# EAGLE schematic Flirry (EAGLE 7.5.0)
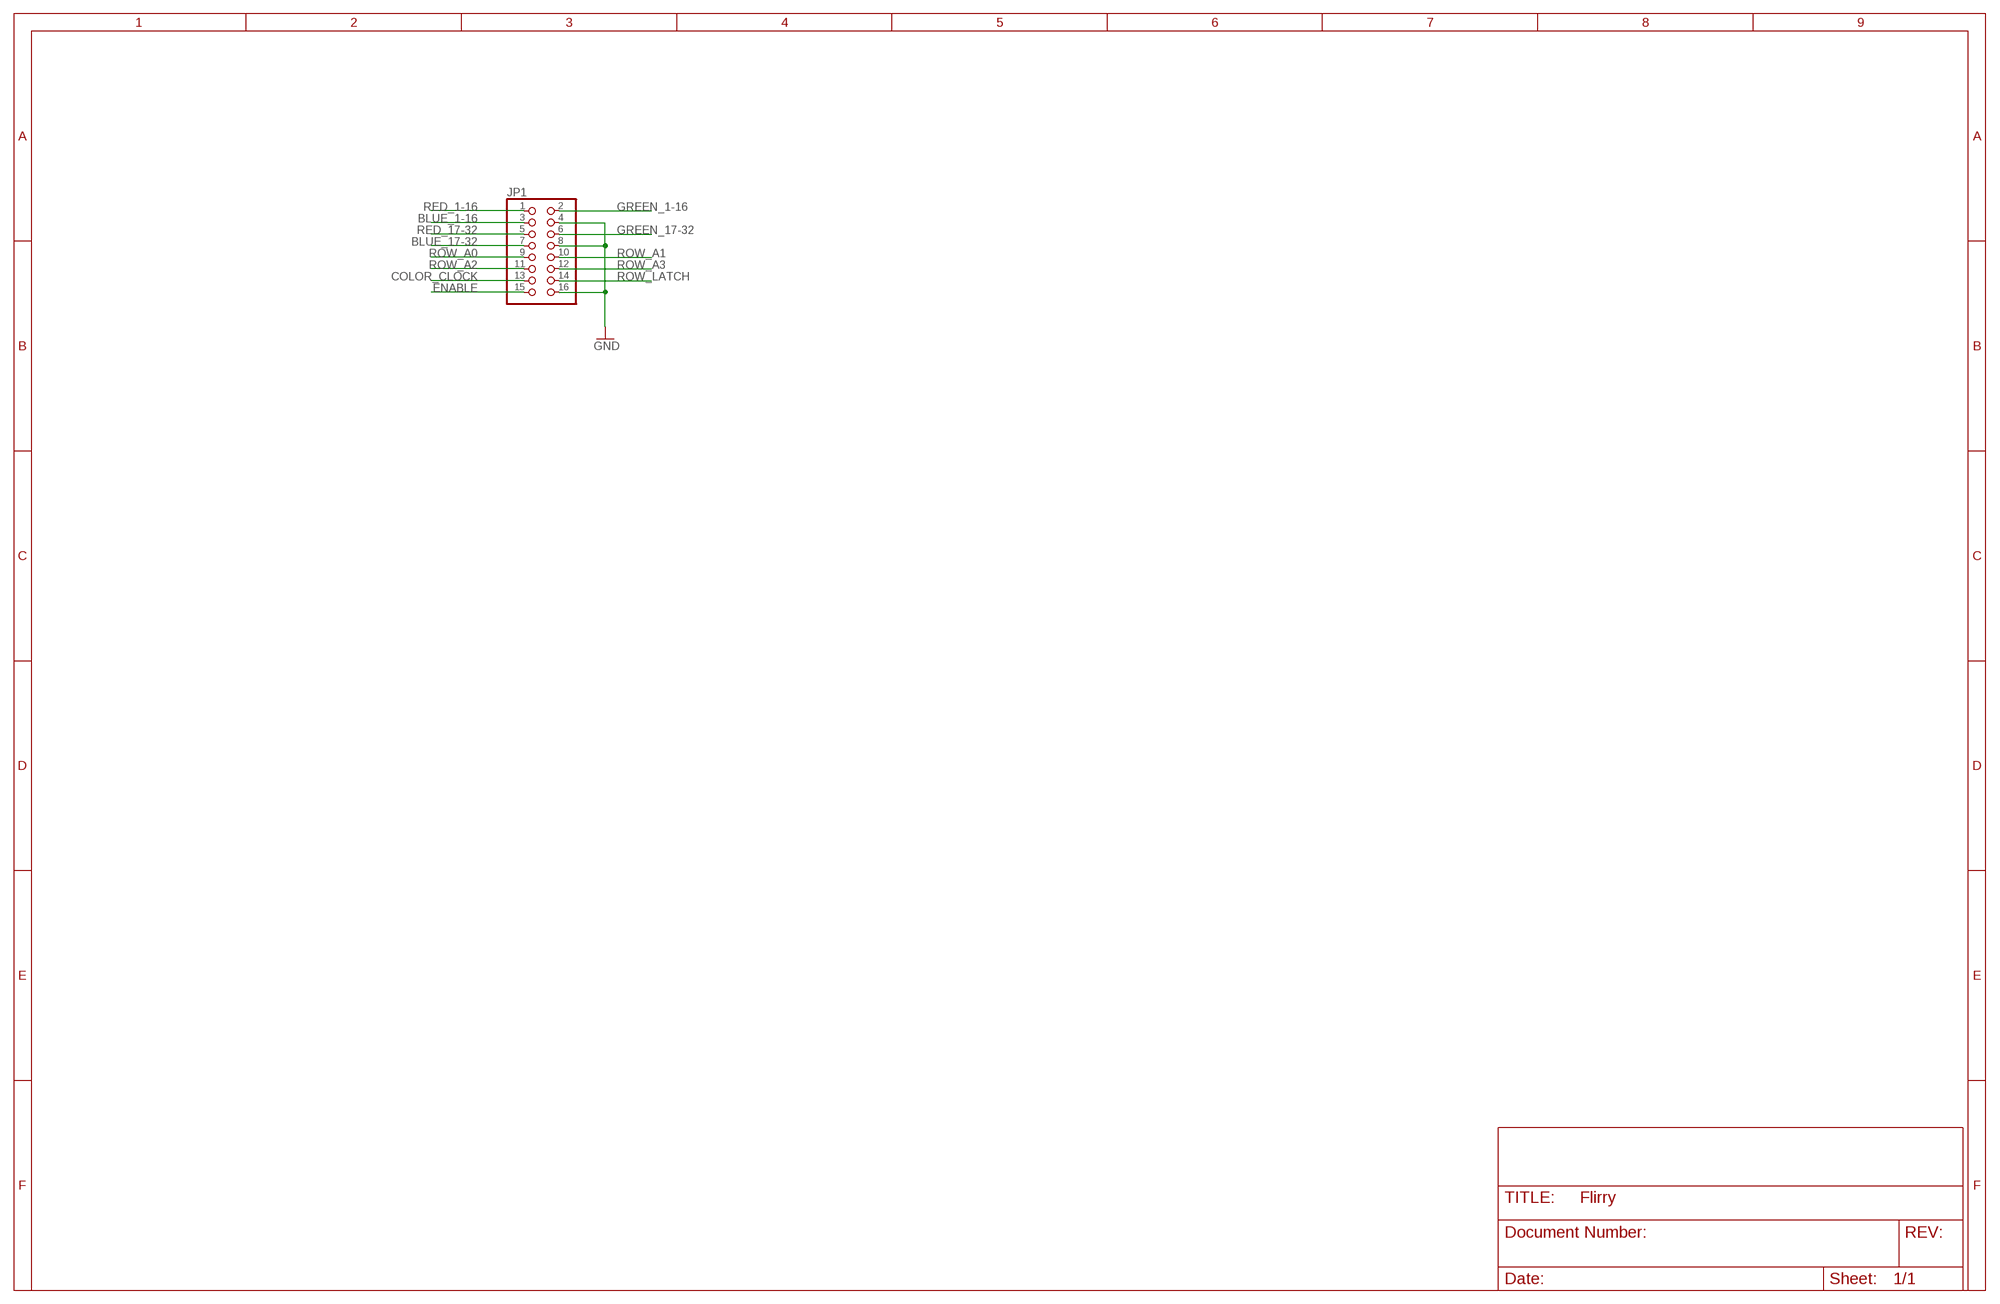
[diagram p0: schematic, sheet 1]

## Parts
JP1  PINHD-2X8  [2X08]

## Nets
BLUE_1-16: JP1.3
BLUE_17-32: JP1.7
COLOR_CLOCK: JP1.13
ENABLE: JP1.15
GND: JP1.4 JP1.8 JP1.16
GREEN_1-16: JP1.2
GREEN_17-32: JP1.6
RED_1-16: JP1.1
RED_17-32: JP1.5
ROW_A0: JP1.9
ROW_A1: JP1.10
ROW_A2: JP1.11
ROW_A3: JP1.12
ROW_LATCH: JP1.14

## Library data of the parts
JP1 = pinhead:PINHD-2X8: PIN HEADER